# Altium schematic sheet PAGE2 - CHARACTERISTIC.SchDoc
size A3; DocumentNumber: 2; SheetNumber: 2; SheetTotal: 2
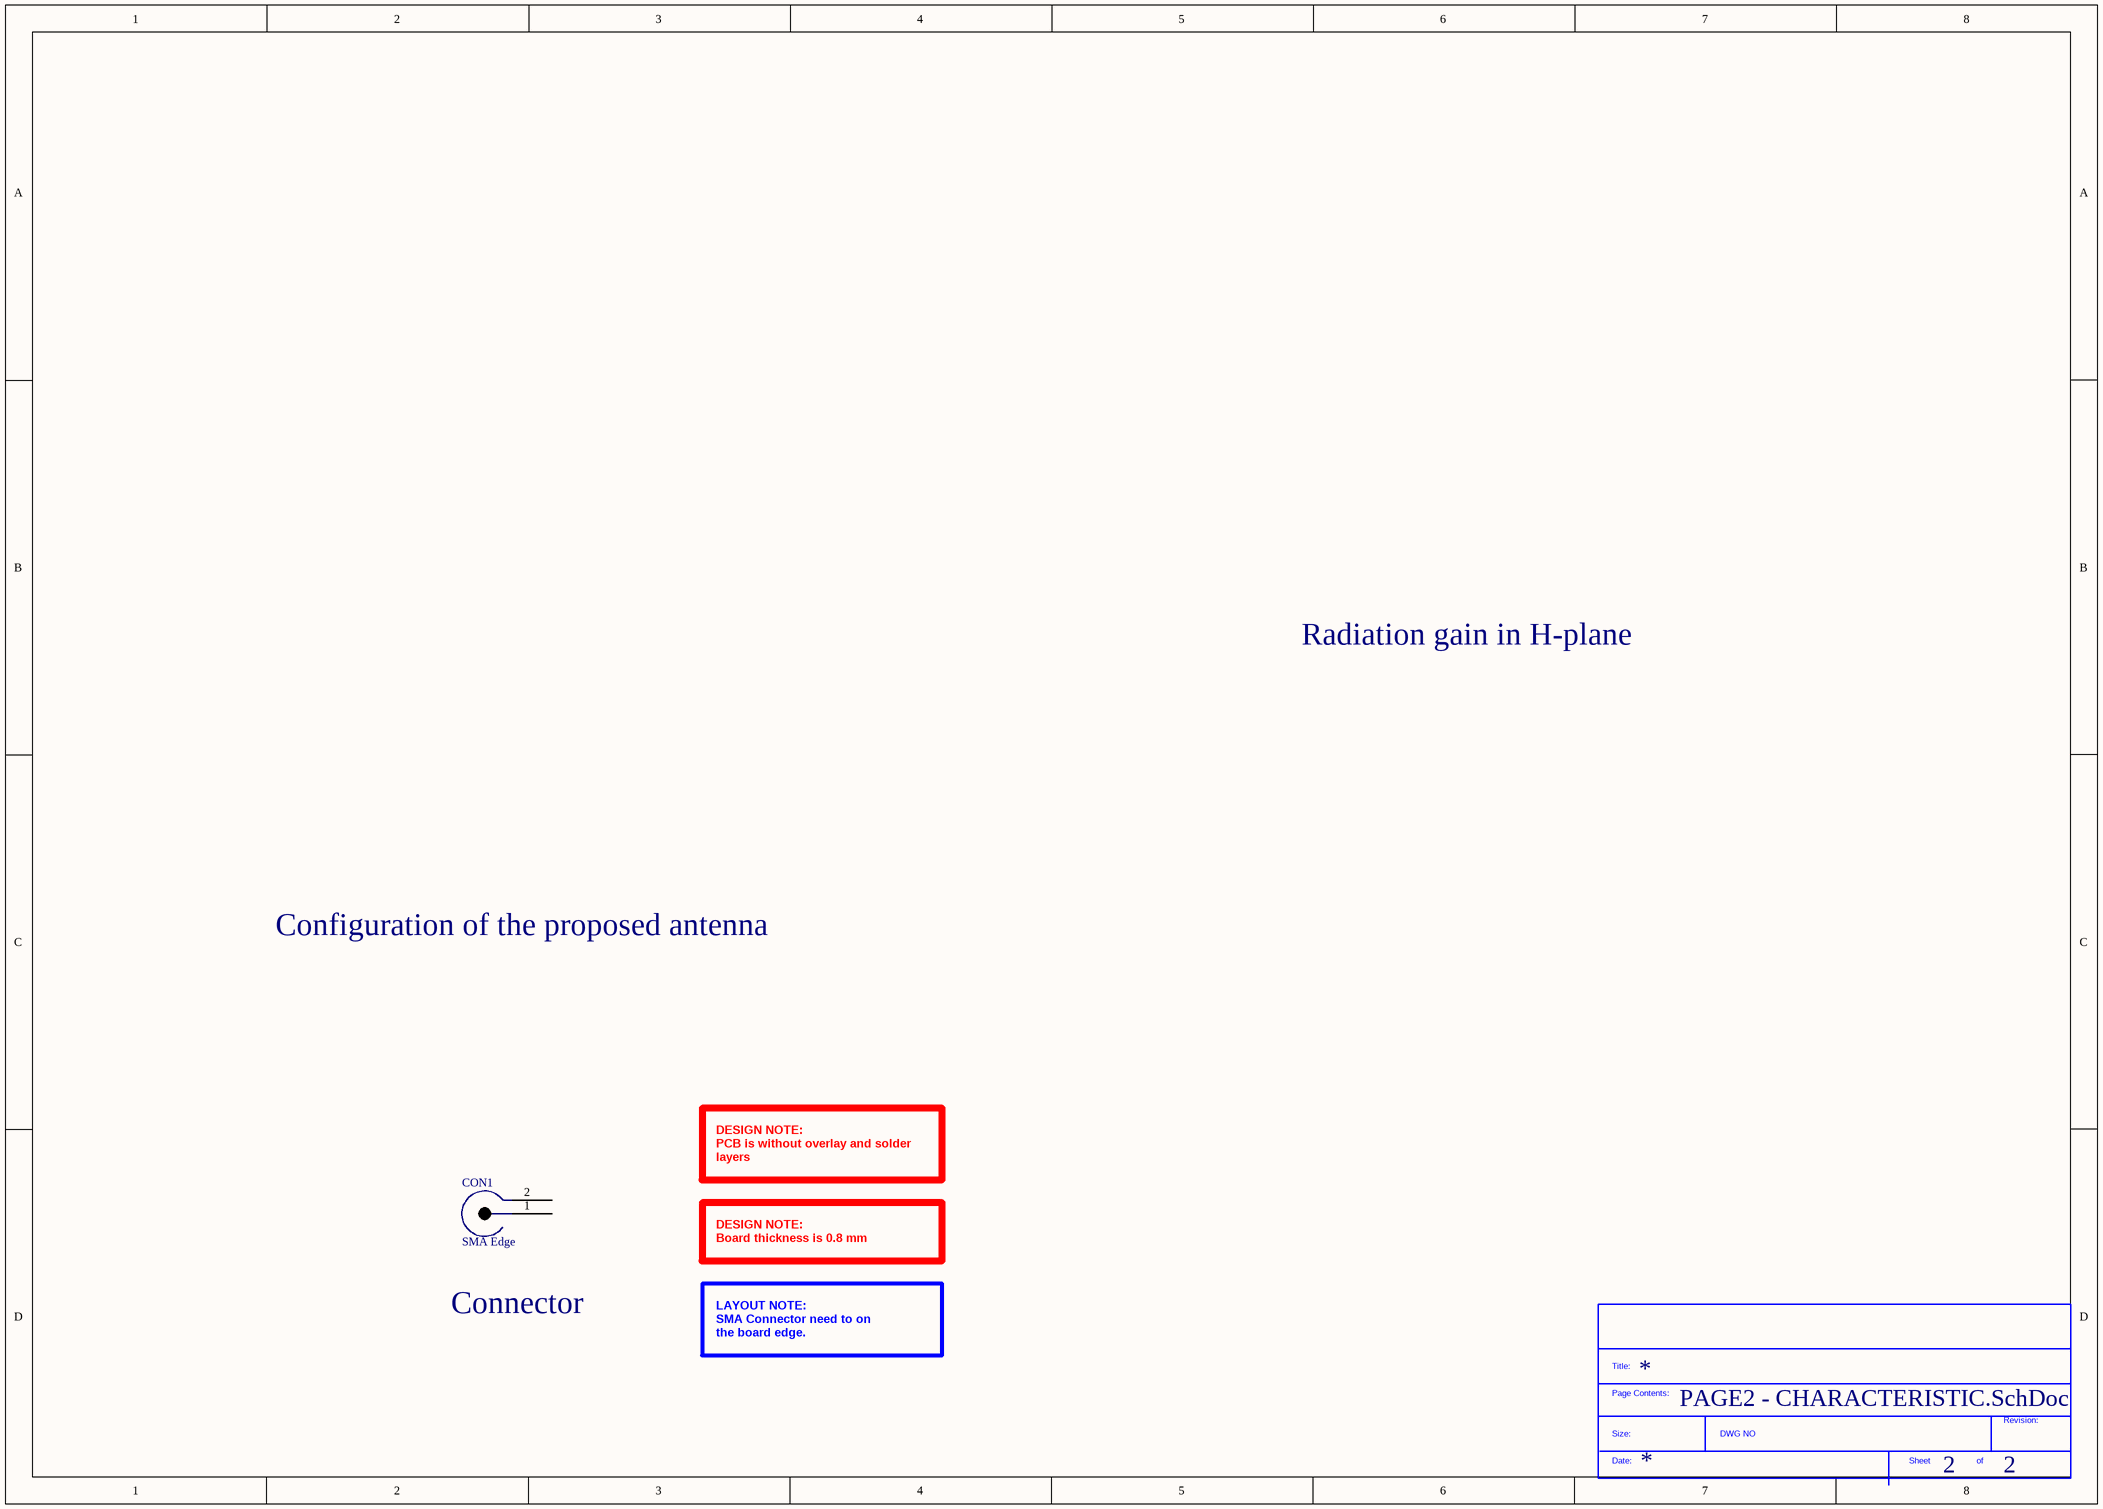
[diagram p0: PAGE2 - CHARACTERISTIC.SchDoc]

## Parts
*?  SDTitleBlock  (value not drawn)  (graphical)
CON1  SMA Edge  [SMA_EDGE_1]

## Nets

Not connected (* = marked no-connect by the designer): CON1 1 2

## Notes on the sheet
- Radiation gain in H-plane
- Configuration of the proposed antenna
- DESIGN NOTE:
  PCB is without overlay and solder layers
- Connector
- DESIGN NOTE:
  Board thickness is 0.8 mm
- LAYOUT NOTE:
  SMA Connector need to on
  the board edge.
- (in symbol SDTitleBlock) Title:; Page Contents:; Revision:; Size:; DWG NO; Date:; Sheet; of

## Library data of the parts
CON1 = 142-0701-881: JOHNSON - 142-0701-881 - RF COAXIAL, SMA, STRAIGHT JACK, 50OHM; Supplier 1: Farnell; Manufacturer: JOHNSON; Manufacturer Part Number: 142-0701-881; RoHS: YES; Stock 1: 770; Pricing 1: 1=3.08 (GBP); ComponentLink1URL: http://www.farnell.com/datasheets/610139.pdf; ComponentLink1Description: http://www.farnell.com/datasheets/610139.pdf; Supplier Part Number 1: 1608603